# Altium project SensWear-V1R0.PrjPcb (part 2 of 2)

## Sheet SensWear_Power.SchDoc
size A4; Size: A4; ApprovedBy: Dariush Salami; DrawnBy: Yusein Ali; Engineer: Yusein Ali; Revision: A0; SheetNumber: 4; SheetTotal: 9
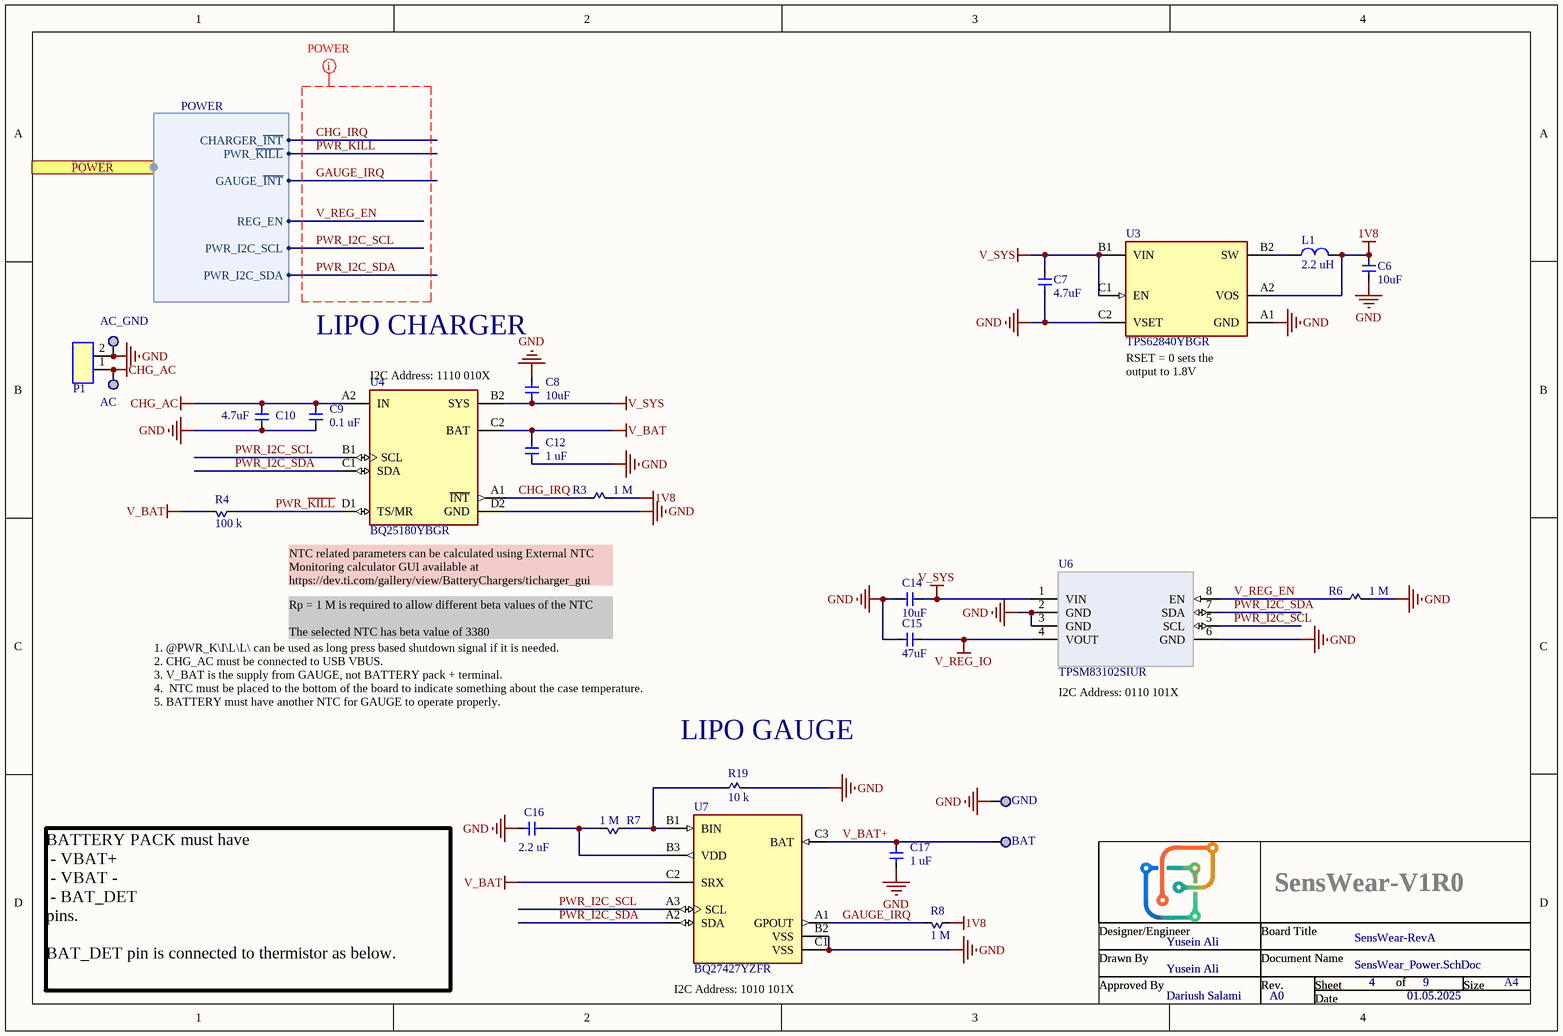
[diagram p3: SensWear_Power.SchDoc]

### Parts
AC  TESTPAD  [TEST_PAD]  (value not drawn)  (no BOM)
AC_GND  TESTPAD  [TEST_PAD]  (value not drawn)  (no BOM)
BAT  TESTPAD  [TEST_PAD]  (value not drawn)  (no BOM)
C6  10uF  [CAPC1005X05N]
C7  4.7uF  [CAPC1005X05N]
C8  10uF  [CAPC1005X05N]
C9  0.1 uF  [CAPC1005X05N]
C10  4.7uF  [CAPC1005X05N]
C12  1 uF  [CAPC1005X05N]
C14  10uF  [CAPC1005X05N]
C15  47uF  [CAPC1610X05N]
C16  2.2 uF  [CAPC1005X05N]
C17  1 uF  [CAPC1005X05N]
GND  TESTPAD  [TEST_PAD]  (value not drawn)  (no BOM)
L1  2.2 uH  [FP-DFE201612C-MFG]
P1  RM-1238-B02-41  [RM-1238-B02-41_2]  (value not drawn)
R3  1 M  [RESC1005X04N]
R4  100 k  [RESC1005X04N]
R6  1 M  [RESC1005X04N]
R7  1 M  [RESC1005X04N]
R8  1 M  [RESC1005X04N]
R19  10 k  [RESC1005X04N]
U3  TPS62840YBGR  [BGA6C40P2X3_97X147X50]
U4  BQ25180YBGR  [BGA8C40P2X4_104X159X50]
U6  TPSM83102SIUR  [MicroSiP8_SIU-A_TEX-M]
U7  BQ27427YZFR  [BGA9C50P3X3_158X162X62]

### Ports
POWER (harness POWER)

### Harnesses
POWER: CHARGER_~{INT}, PWR_I2C_SCL, PWR_~{KILL}, GAUGE_~{INT}, PWR_I2C_SDA, REG_EN

### Nets
1V8: C6.1 L1.2 R3.1 R8.1 U3.A2(VOS)
CHG_AC: AC.1 C9.1 C10.2 P1.1 U4.A2(IN)
GND: AC_GND.1 C6.2 C7.1 C8.2 C9.2 C10.1 C12.2 C14.1 C15.1 C16.2 C17.2 GND.1 P1.2 R6.1 R19.2 U3.A1(GND) U3.C2(VSET) U4.D2(GND) U6.2(GND) U6.3(GND) U6.6(GND) U7.B2(VSS) U7.C1(VSS)
V_BAT: C12.1 R4.2 U4.C2(BAT) U7.C2(SRX)
V_REG_IO: C15.2 U6.4(VOUT)
V_SYS: C7.2 C8.1 C14.2 U3.B1(VIN) U3.C1(EN) U4.B2(SYS) U6.1(VIN)
CHG_IRQ: R3.2 U4.A1(~{INT}) ; port POWER.CHARGER_~{INT}
GAUGE_IRQ: R8.2 U7.A1(GPOUT) ; port POWER.GAUGE_~{INT}
PWR_I2C_SCL: U4.B1(SCL) U6.5(SCL) U7.A3(SCL) ; port POWER.PWR_I2C_SCL
PWR_I2C_SDA: U4.C1(SDA) U6.7(SDA) U7.A2(SDA) ; port POWER.PWR_I2C_SDA
PWR_~{KILL}: R4.1 U4.D1(TS/MR) ; port POWER.PWR_~{KILL}
V_BAT+: BAT.1 C17.1 U7.C3(BAT)
V_REG_EN: R6.2 U6.8(EN) ; port POWER.REG_EN
NetC16_1: C16.1 R7.2 U7.B3(VDD)
NetL1_1: L1.1 U3.B2(SW)
NetR7_1: R7.1 R19.1 U7.B1(BIN)

### Layout directives
net class PWR Control: CHG_IRQ, GAUGE_IRQ, PWR_I2C_SCL, PWR_I2C_SDA, PWR_~{KILL}, V_REG_EN

### Notes on the sheet
- LIPO CHARGER
- I2C Address: 1110 010X
- (near U3) RSET = 0 sets the output to 1.8V
- NTC related parameters can be calculated using External NTC Monitoring calculator GUI available at https://dev.ti.com/gallery/view/BatteryChargers/ticharger_gui
- Rp = 1 M is required to allow different beta values of the NTC
  The selected NTC has beta value of 3380
- 1. @PWR_K\I\L\L\ can be used as long press based shutdown signal if it is needed.
  2. CHG_AC must be connected to USB VBUS.
  3. V_BAT is the supply from GAUGE, not BATTERY pack + terminal.
  4.  NTC must be placed to the bottom of the board to indicate something about the case temperature.
  5. BATTERY must have another NTC for GAUGE to operate properly.
- (near U6) I2C Address: 0110 101X
- (near R19) LIPO GAUGE
- BATTERY PACK must have
  - VBAT+
  - VBAT -
  - BAT_DET
  pins.
  BAT_DET pin is connected to thermistor as below.
- (near U7) I2C Address: 1010 101X
- Designer/Engineer
- Drawn By
- Document Name
- Board Title
- Sheet
- of
- Size
- A4
- Approved By
- Rev.
- Date

### Library data of the parts
AC AC_GND BAT GND = TESTPAD: TESTPOINT PIN SMD; Category: Test and Measurement; Type: PC Test Point; Mounting Type: Surface Mount; Color: -
C6 C8 C14 = CL05A106MP5NUNC: Multilayer Ceramic Capacitor, 10 uF, 10 V, ± 20%, X5R, 0402 [1005 Metric]; Manufacturer: Samsung; Voltage Rating: 10V; Supplier: Arrow Electronics; Supplier Part Number: CL05A106MP5NUNC; Manufacturer Part Number: CL05A106MP5NUNC; RoHS: Yes; Category: Ceramic Capacitors; Stock: 275; Pricing: 1=0,1584, 10=0,0737, 25=0,073, 100=0,0424, 250=0,042, 500=0,0416, 1000=0,0375 (USD); Mounting Technology: Surface Mount; Case/Package: 0402; Case Code (Metric): 1005; Case Code (Imperial): 0402; Min Operating Temperature: -55°C; Max Operating Temperature: 85°C; Package Quantity: 1; Packaging: Tape and Reel; Value: 10uF; Tolerance: 20%; Dielectric: X5R; Series: CL; Length: 1mm; Width: 0.02inch; Thickness: 0.028inch; Depth: 0.5mm; Radiation Hardening: No; Lead Free: Lead Free; RoHS Compliant: Yes; ComponentLink1URL: https://datasheet.ciiva.com/25721/cl05a106mp5nunc-25721584.pdf?src-supplier=Digi-Key; ComponentLink1Description: https://datasheet.ciiva.com/25721/cl05a106mp5nunc-25721584.pdf?src-supplier=Digi-Key; ComponentLink2URL: https://datasheet.ciiva.com/26838/getdatasheetpartid-745310-26838170.pdf?src-supplier=Verical; ComponentLink2Description: https://datasheet.ciiva.com/26838/getdatasheetpartid-745310-26838170.pdf?src-supplier=Verical; Supplier 1: Mouser; Supplier Part Number 1: 187-CL05A106MP5NUNC; Supplier 2: Digikey; Supplier Part Number 2: 1276-1450-1-ND
C7 C10 = GRM155R61A475MEAAD: Multilayer Ceramic Capacitor, 4.7 uF, 10 V, ± 20%, X5R, 0402 [1005 Metric]; Manufacturer: Murata; Material: 4241ConductorMaterial; Voltage Rating: 10V; Dielectric: 1537DielectricType; Manufacturer Part Number: GRM155R61A475MEAAD; RoHS: Yes; Category: Ceramic Capacitors; Stock: 930000; Pricing: 10000=0,0187, 50000=0,0159, 100000=0,0132 (USD); Mounting Technology: Surface Mount; Case/Package: 0402; Case Code (Imperial): 0402; Case Code (Metric): 1005; Min Operating Temperature: -55°C; Max Operating Temperature: 85°C; Packaging: Tape and Reel; Value: 4.7uF; Tolerance: 20%; Series: GRM; Voltage Rating (DC): 10V; Length: 1mm; Width: 500um; Height: 650um; Thickness: 500um; RoHS Compliant: Yes; ComponentLink1URL: http://www.farnell.com/datasheets/2189109.pdf?src-supplier=Farnell; ComponentLink1Description: http://www.farnell.com/datasheets/2189109.pdf?src-supplier=Farnell; ComponentLink2URL: http://www.farnell.com/datasheets/2189109.pdf?src-supplier=Newark; ComponentLink2Description: http://www.farnell.com/datasheets/2189109.pdf?src-supplier=Newark; ComponentLink3URL: http://www.farnell.com/datasheets/2189109.pdf?src-supplier=Element14; ComponentLink3Description: http://www.farnell.com/datasheets/2189109.pdf?src-supplier=Element14; ComponentLink4URL: http://datasheet.octopart.com/GRM155R61A475MEAAD-Murata-datasheet-68589269.pdf?src-supplier=Distrelec; ComponentLink4Description: http://datasheet.octopart.com/GRM155R61A475MEAAD-Murata-datasheet-68589269.pdf?src-supplier=Distrelec; ComponentLink5URL: http://datasheet.octopart.com/GRM155R61A475MEAAD-Murata-datasheet-68589269.pdf?src-supplier=Farnell; ComponentLink5Description: http://datasheet.octopart.com/GRM155R61A475MEAAD-Murata-datasheet-68589269.pdf?src-supplier=Farnell; ComponentLink6URL: https://search.murata.co.jp/Ceramy/image/img/A01X/G101/ENG/GRM155R61A475MEAA-01.pdf?src-supplier=Digi-Key; ComponentLink6Description: https://search.murata.co.jp/Ceramy/image/img/A01X/G101/ENG/GRM155R61A475MEAA-01.pdf?src-supplier=Digi-Key; ComponentLink7URL: http://datasheet.octopart.com/GRM155R61A475MEAAD-Murata-datasheet-68589269.pdf?src-supplier=Future+Electronics; ComponentLink7Description: http://datasheet.octopart.com/GRM155R61A475MEAAD-Murata-datasheet-68589269.pdf?src-supplier=Future+Electronics; ComponentLink8URL: https://datasheet.octopart.com/GRM155R61A475MEAAD-Murata-datasheet-68589269.pdf?src-supplier=Newark; ComponentLink8Description: https://datasheet.octopart.com/GRM155R61A475MEAAD-Murata-datasheet-68589269.pdf?src-supplier=Newark; ComponentLink9URL: http://datasheet.octopart.com/GRM155R61A475MEAAD-Murata-datasheet-68589269.pdf?src-supplier=Verical; ComponentLink9Description: http://datasheet.octopart.com/GRM155R61A475MEAAD-Murata-datasheet-68589269.pdf?src-supplier=Verical; ComponentLink10URL: https://datasheet.octopart.com/GRM155R61A475MEAAD-Murata-datasheet-165579666.pdf?src-supplier=TME; ComponentLink10Description: https://datasheet.octopart.com/GRM155R61A475MEAAD-Murata-datasheet-165579666.pdf?src-supplier=TME; ComponentLink11URL: http://datasheet.octopart.com/GRM155R61A475MEAAD-Murata-datasheet-68589269.pdf?src-supplier=Quest; ComponentLink11Description: http://datasheet.octopart.com/GRM155R61A475MEAAD-Murata-datasheet-68589269.pdf?src-supplier=Quest; ComponentLink12URL: http://datasheet.octopart.com/GRM155R61A475MEAAD-Murata-datasheet-68589269.pdf?src-supplier=TTI; ComponentLink12Description: http://datasheet.octopart.com/GRM155R61A475MEAAD-Murata-datasheet-68589269.pdf?src-supplier=TTI; ComponentLink13URL: http://datasheet.octopart.com/GRM155R61A475MEAAD-Murata-datasheet-68589269.pdf?src-supplier=NAC+Semi; ComponentLink13Description: http://datasheet.octopart.com/GRM155R61A475MEAAD-Murata-datasheet-68589269.pdf?src-supplier=NAC+Semi; Supplier 1: Mouser; Supplier Part Number 1: 81-GRM155R61A475MEAD; Supplier 2: Farnell; Supplier Part Number 2: 3581674
C9 = GRM155R61C104KA88D: CAP CER 0.1UF 16V X5R 0402; Manufacturer: Murata Electronics; Tolerance: 10 %; Type: Chip Multilayer Ceramic Capacitor for General Purpose; Voltage Rating DC: 16 VDC; Capacitance - nF: 100 nF; Capacitance - pF: 100000 pF; Supplier 1: Mouser; Manufacturer Part Number: GRM155R61C104KA88D; RoHS: RoHS Compliant; Category: Multilayer Ceramic Capacitors MLCC - SMD/SMT; Packaging: Cut Tape; Capacitance: 0.1 uF; Package / Case: 0402 (1005 metric); ComponentLink1URL: http://www.mouser.com/datasheet/2/281/murata_03052018_GRM_Series_1-1310166.pdf; ComponentLink1Description: http://www.mouser.com/datasheet/2/281/murata_03052018_GRM_Series_1-1310166.pdf; Supplier Part Number 1: 81-GRM155R61C104KA8D; Value: 0.1 uF; Stock: 0; Pricing: 1=0.082, 10=0.026, 100=0.011, 500=0.008, 1000=0.007, 2500=0.006, 5000=0.005, 10000=0.004 (EUR); Height: 0.5 mm; Length: 1 mm; Product: General Type MLCCs; Series: GRM; Termination Style: SMD/SMT; Width: 0.5 mm; Brand: Murata Electronics; Case Code - in: 0402; Case Code - mm: 1005; Dielectric: X5R; Maximum Operating Temperature: + 85 C; Minimum Operating Temperature: - 55 C; Standard Pack Qty: 10000; Termination: Standard; RoHS - Mouser: Y; Minimum Order Quantity: 1; Reeling: True; Supplier 2: Digikey; Supplier Part Number 2: 490-5415-1-ND; Supplier 3: Digikey; Supplier Part Number 3: 490-5415-6-ND
C12 C17 = GRM155R61A105KE15D: CAP CER 1UF 10V X5R 0402; Manufacturer: Murata Electronics North America; Capacitance: 1µF; Tolerance: ±10%; Supplier 1: Digi-Key; Manufacturer Part Number: GRM155R61A105KE15D; RoHS: RoHS Compliant; Category: Capacitors; Stock 1: 5520111; Pricing 1: 1=0.1, 10=0.024, 50=0.013, 100=0.011, 250=0.009, 500=0.0077, 1000=0.006, 5000=0.005 (USD); Packaging: Digi-Reel®; Part Status: Active; Voltage - Rated: 10V; Temperature Coefficient: X5R; Mounting Type: Surface Mount, MLCC; Operating Temperature: -55°C ~ 85°C; Applications: General Purpose; Ratings: -; Package / Case: 0402 (1005 Metric); Size / Dimension: 0.039" L x 0.020" W (1.00mm x 0.50mm); Height - Seated (Max): -; Thickness (Max): 0.022" (0.55mm); Lead Spacing: -; Features: -; Lead Style: -; ComponentLink1URL: http://www.murata.com/~/media/webrenewal/support/library/catalog/products/capacitor/mlcc/c02e.ashx; ComponentLink1Description: http://www.murata.com/~/media/webrenewal/support/library/catalog/products/capacitor/mlcc/c02e.ashx; Supplier Part Number 1: 490-3890-6-ND; Value: 1 uF
C15 = CL10A476MQ8QRNC: CL10 Series 0603 47 uF 6.3 V ±20% Tolerance X5R Multilayer Ceramic Capacitor; Manufacturer: Samsung; Supplier: Digikey; Supplier Part Number: 1276-CL10A476MQ8QRNCCT-ND; Manufacturer Part Number: CL10A476MQ8QRNC; RoHS: Yes; Category: Ceramic Capacitors; Stock: 103327; Pricing: 1=1.04, 10=0.669, 100=0.477, 1000=0.37689 (USD); Case/Package: 345Case; Min Operating Temperature: -55°C; Max Operating Temperature: 85°C; Value: 47uF; Tolerance: 20%; Lead Free: 5697LeadFree; RoHS Compliant: 5897YesNo; ComponentLink1URL: https://datasheet.octopart.com/CL10A476MQ8QRNC-Samsung-Electro-Mechanics-datasheet-68300278.pdf?src-supplier=Future+Electronics; ComponentLink1Description: https://datasheet.octopart.com/CL10A476MQ8QRNC-Samsung-Electro-Mechanics-datasheet-68300278.pdf?src-supplier=Future+Electronics; Supplier 1: Digikey; Supplier Part Number 1: 1276-CL10A476MQ8QRNCCT-ND; Supplier 2: Digikey; Supplier Part Number 2: 1276-CL10A476MQ8QRNCDKR-ND
C16 = GRM155R61A225KE95D: CAP CER 2.2UF 10V X5R 0402; Manufacturer: Murata Electronics North America; Capacitance: 2.2µF; Tolerance: ±10%; Supplier 1: Digi-Key; Manufacturer Part Number: GRM155R61A225KE95D; RoHS: RoHS Compliant; Category: Capacitors; Stock 1: 370562; Pricing 1: 1=0.1, 10=0.06, 50=0.0326, 100=0.0275, 250=0.02252, 500=0.01926, 1000=0.015, 5000=0.0125 (USD); Packaging: Digi-Reel®; Part Status: Active; Voltage - Rated: 10V; Temperature Coefficient: X5R; Operating Temperature: -55°C ~ 85°C; Features: Derating Recommended; Ratings: -; Applications: General Purpose; Mounting Type: Surface Mount, MLCC; Package / Case: 0402 (1005 Metric); Size / Dimension: 0.039" L x 0.020" W (1.00mm x 0.50mm); Height - Seated (Max): -; Thickness (Max): 0.022" (0.55mm); Lead Spacing: -; Lead Style: -; ComponentLink1URL: http://www.murata.com/~/media/webrenewal/support/library/catalog/products/capacitor/mlcc/c02e.ashx; ComponentLink1Description: http://www.murata.com/~/media/webrenewal/support/library/catalog/products/capacitor/mlcc/c02e.ashx; Supplier Part Number 1: 490-10451-6-ND; Value: 2.2 uF
L1 = DFE201612E-2R2M=P2: Inductor Power Shielded Wirewound 2.2uH 20% 1MHz Metal 1.8A 0.116Ohm DCR 0806 T/R; Manufacturer: Murata; Saturation Current: 2.4A; ESR: 116mR; Supplier: Mouser; Supplier Part Number: 81-DFE201612E-2R2MP2; Manufacturer Part Number: DFE201612E-2R2M=P2; RoHS: Yes; Category: Fixed Inductors; Stock: 102000; Pricing: 3000=0,0929 (USD); ComponentLink1URL: http://www.farnell.com/datasheets/2339714.pdf?src-supplier=Farnell; ComponentLink1Description: http://www.farnell.com/datasheets/2339714.pdf?src-supplier=Farnell; ComponentLink2URL: https://search.murata.co.jp/Ceramy/image/img/P02/J(E)TE243A-0006.pdf?src-supplier=Digi-Key; ComponentLink2Description: https://search.murata.co.jp/Ceramy/image/img/P02/J(E)TE243A-0006.pdf?src-supplier=Digi-Key; ComponentLink3URL: http://www.farnell.com/datasheets/2339714.pdf?src-supplier=Newark; ComponentLink3Description: http://www.farnell.com/datasheets/2339714.pdf?src-supplier=Newark; ComponentLink4URL: https://datasheet.octopart.com/DFE201612E-2R2M%3DP2-Murata-datasheet-150582460.pdf?src-supplier=Arrow.cn; ComponentLink4Description: https://datasheet.octopart.com/DFE201612E-2R2M%3DP2-Murata-datasheet-150582460.pdf?src-supplier=Arrow.cn; Supplier 1: Mouser; Supplier Part Number 1: 81-DFE201612E-2R2MP2; Value: 2.2 uH; Min Operating Temperature: -40°C; Max Operating Temperature: 125°C; Current Rating: 1.8A; Inductance Tolerance: 20%; Packaging: 13Packaging; RMS Current (Irms): 1.8A; Test Frequency: 1MHz; Height: 1.2mm; ComponentLink5URL: https://search.murata.co.jp/Ceramy/image/img/P02/J(E)TE243A-0006.pdf?src-supplier=Digikey; ComponentLink5Description: https://search.murata.co.jp/Ceramy/image/img/P02/J(E)TE243A-0006.pdf?src-supplier=Digikey; Supplier 2: Digikey; Supplier Part Number 2: 490-DFE201612E-2R2M=P2CT-ND; Supplier 3: Digikey; Supplier Part Number 3: 490-DFE201612E-2R2M=P2DKR-ND
P1 = RM-1238-B02-41: RM-1238-B02-41 by www.xtpogopin.com; Manufacturer: XTPogoPin; Manufacturer Part Number: RM-1238-B02-41
R3 R6-R8 = ERJ-2RKF1004X: RES SMD 1M OHM 1% 1/10W 0402; Manufacturer: Panasonic Electronic Components; Power (Watts): 0.1W, 1/10W; Temperature Coefficient: ±100ppm/°C; Supplier 1: Digi-Key; Manufacturer Part Number: ERJ-2RKF1004X; RoHS: RoHS Compliant; Category: Resistors; Stock 1: 1590446; Pricing 1: 1=0.1, 10=0.025, 25=0.018, 50=0.0136, 100=0.01, 250=0.00764, 500=0.00612, 1000=0.00451, 5000=0.00323 (USD); Packaging: Digi-Reel®; Part Status: Active; Resistance (Ohms): 1M; Tolerance: ±1%; Composition: Thick Film; Features: Automotive AEC-Q200; Operating Temperature: -55°C ~ 155°C; Package / Case: 0402 (1005 Metric); Supplier Device Package: 0402; Size / Dimension: 0.039" L x 0.020" W (1.00mm x 0.50mm); Number of Terminations: 2; Failure Rate: -; ComponentLink1URL: https://industrial.panasonic.com/cdbs/www-data/pdf/RDA0000/AOA0000C283.pdf; ComponentLink1Description: https://industrial.panasonic.com/cdbs/www-data/pdf/RDA0000/AOA0000C283.pdf; Supplier Part Number 1: P1.00MLDKR-ND; Value: 1 M; Height - Seated (Max): 0.016" (0.40mm)
R4 = ERJ-2RKF1003X: RES SMD 100K OHM 1% 1/10W 0402; Manufacturer: Panasonic Electronic Components; Power (Watts): 0.1W, 1/10W; Temperature Coefficient: ±100ppm/°C; Supplier 1: Digi-Key; Manufacturer Part Number: ERJ-2RKF1003X; RoHS: RoHS Compliant; Category: Resistors; Stock 1: 5976308; Pricing 1: 1=0.1, 10=0.025, 25=0.018, 50=0.0136, 100=0.01, 250=0.00764, 500=0.00612, 1000=0.00451, 5000=0.00323 (USD); Packaging: Digi-Reel®; Part Status: Active; Resistance (Ohms): 100k; Tolerance: ±1%; Composition: Thick Film; Features: Automotive AEC-Q200; Operating Temperature: -55°C ~ 155°C; Package / Case: 0402 (1005 Metric); Supplier Device Package: 0402; Size / Dimension: 0.039" L x 0.020" W (1.00mm x 0.50mm); Height - Seated (Max): 0.016" (0.40mm); Number of Terminations: 2; Failure Rate: -; ComponentLink1URL: https://industrial.panasonic.com/cdbs/www-data/pdf/RDA0000/AOA0000C283.pdf; ComponentLink1Description: https://industrial.panasonic.com/cdbs/www-data/pdf/RDA0000/AOA0000C283.pdf; Supplier Part Number 1: P100KLDKR-ND; Value: 100 k
R19 = ERJ-2RKF1002X: RES SMD 10K OHM 1% 1/10W 0402; Manufacturer: Panasonic Electronic Components; Power (Watts): 0.1W, 1/10W; Temperature Coefficient: ±100ppm/°C; Supplier 1: Digi-Key; Manufacturer Part Number: ERJ-2RKF1002X; RoHS: RoHS Compliant; Category: Resistors; Stock 1: 8105773; Pricing 1: 1=0.1, 10=0.025, 25=0.018, 50=0.0136, 100=0.01, 250=0.00764, 500=0.00612, 1000=0.00451, 5000=0.00323 (USD); Packaging: Digi-Reel®; Part Status: Active; Resistance (Ohms): 10k; Tolerance: ±1%; Composition: Thick Film; Features: Automotive AEC-Q200; Operating Temperature: -55°C ~ 155°C; Package / Case: 0402 (1005 Metric); Supplier Device Package: 0402; Size / Dimension: 0.039" L x 0.020" W (1.00mm x 0.50mm); Height - Seated (Max): 0.016" (0.40mm); Number of Terminations: 2; Failure Rate: -; ComponentLink1URL: https://industrial.panasonic.com/cdbs/www-data/pdf/RDA0000/AOA0000C283.pdf; ComponentLink1Description: https://industrial.panasonic.com/cdbs/www-data/pdf/RDA0000/AOA0000C283.pdf; Supplier Part Number 1: P10.0KLDKR-ND; Value: 10 k
U3 = TPS62840YBGR: Conv DC-DC 1.8V to 6.5V Synchronous Step Down Single-Out 1.8V to 3.3V 0.75A 6-Pin DSBGA T/R; Manufacturer: Texas Instruments; Supplier: Mouser; Supplier Part Number: 595-TPS62840YBGR; Manufacturer Part Number: TPS62840YBGR; RoHS: Yes; Category: Voltage Regulators - Switching; Stock: 2271; Pricing: 1=1,97, 10=1,77, 50=1,77, 100=1,42, 1000=0,972, 10000=0,865 (USD); Supplier 1: Mouser; Supplier Part Number 1: 595-TPS62840YBGR
U4 = BQ25180YBGR: 1-A Li-ion I²C programmable charger with regulated power path in WCSP package 8-DSBGA -40 to 85; Manufacturer: Texas Instruments; Supplier: Digi-Key; Supplier Part Number: 296-BQ25180YBGRCT-ND; Manufacturer Part Number: BQ25180YBGR; RoHS: No; Category: Integrated Circuits (ICs); Stock: 2812; Pricing: 1=2,65, 10=2,382, 25=2,2472, 100=1,9147, 250=1,7978, 500=1,57308, 1000=1,3034 (USD); Supplier 1: Mouser; Supplier Part Number 1: 595-BQ25180YBGR
U6 = TPSM83102SIUR: 1.5A output current, buck-boost MicroSiP™ power module with integrated inductor with I²C 8-uSiP -40 to 125; Manufacturer: Texas Instruments; Supplier: Mouser; Supplier Part Number: 595-TPSM83102SIUR; Manufacturer Part Number: TPSM83102SIUR; RoHS: No; Stock: 2997; Pricing: 1=6.7, 10=6.01, 50=6.01, 100=4.93, 1000=4.51, 10000=3.83 (USD); Pins: 8; Topology: Buck-Boost; Length: 2.6mm; Width: 2mm; Thickness: 1.15mm; Supplier 1: Mouser; Supplier Part Number 1: 595-TPSM83102SIUR; Supplier 2: Digikey; Supplier Part Number 2: 296-TPSM83102SIURCT-ND
U7 = BQ27427YZFR: Single-cell battery fuel gauge with pre-programmed chemistry and integrated sense resistor 9-DSBGA -40 to 85; Manufacturer: Texas Instruments; Supplier: Mouser; Supplier Part Number: 595-BQ27427YZFR; Manufacturer Part Number: BQ27427YZFR; RoHS: No; Stock: 1221; Pricing: 1=2,56, 10=2,31, 50=2,18, 100=1,86, 1000=1,26, 10000=1,15 (USD); Supplier 1: Mouser; Supplier Part Number 1: 595-BQ27427YZFR

## Sheet SensWear_MPU.SchDoc
size A4; Size: A4; ApprovedBy: Dariush Salami; DrawnBy: Yusein Ali; Engineer: Yusein Ali; Revision: A0; SheetNumber: 5; SheetTotal: 9
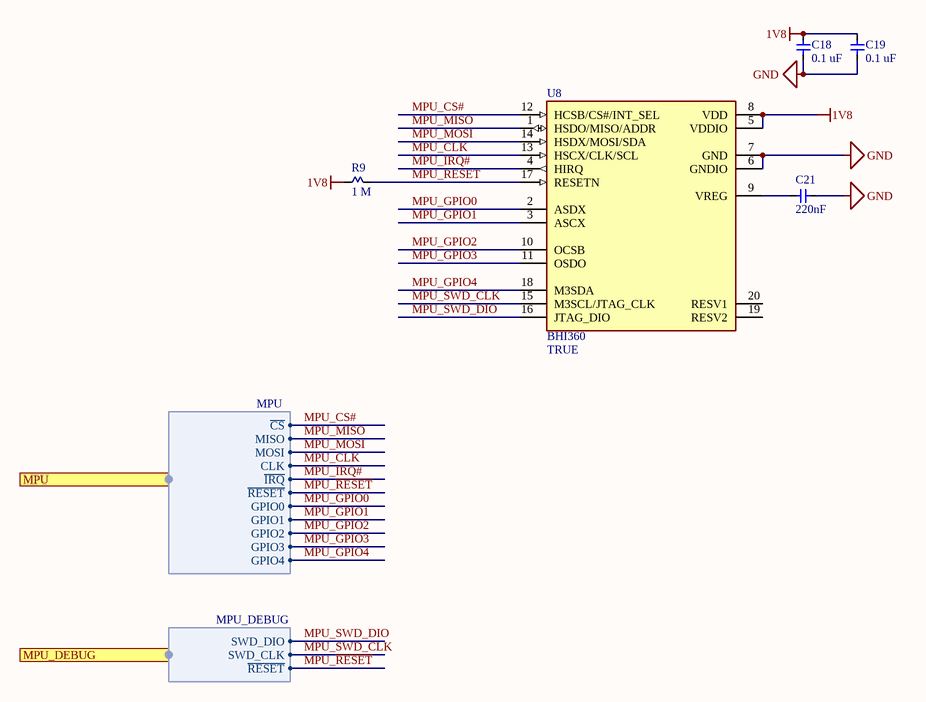
[diagram p4: SensWear_MPU.SchDoc]

### Parts
C18  0.1 uF  [CAPC1005X05N]
C19  0.1 uF  [CAPC1005X05N]
C21  220nF  [CAPC1005X05N]
R9  1 M  [RESC1005X04N]
U8  BHI360  Checked: TRUE  [BHI360]

### Ports
MPU (harness MPU), MPU_DEBUG (harness MPU_DEBUG)

### Harnesses
MPU: ~{CS}, MISO, MOSI, CLK, ~{IRQ}, ~{RESET}, GPIO0, GPIO1, GPIO2, GPIO3, GPIO4
MPU_DEBUG: SWD_DIO, SWD_CLK, ~{RESET}

### Nets
1V8: C18.2 C19.2 R9.1 U8.5(VDDIO) U8.8(VDD)
GND: C18.1 C19.1 C21.2 U8.6(GNDIO) U8.7(GND)
MPU_CLK: U8.13(HSCX/CLK/SCL) ; port MPU.CLK
MPU_CS#: U8.12(HCSB/CS#/INT_SEL) ; port MPU.~{CS}
MPU_GPIO0: U8.2(ASDX) ; port MPU.GPIO0
MPU_GPIO1: U8.3(ASCX) ; port MPU.GPIO1
MPU_GPIO2: U8.10(OCSB) ; port MPU.GPIO2
MPU_GPIO3: U8.11(OSDO) ; port MPU.GPIO3
MPU_GPIO4: U8.18(M3SDA) ; port MPU.GPIO4
MPU_IRQ#: U8.4(HIRQ) ; port MPU.~{IRQ}
MPU_MISO: U8.1(HSDO/MISO/ADDR) ; port MPU.MISO
MPU_MOSI: U8.14(HSDX/MOSI/SDA) ; port MPU.MOSI
MPU_~{RESET}: R9.2 U8.17(RESETN) ; port MPU.~{RESET}, port MPU_DEBUG.~{RESET}
MPU_SWD_CLK: U8.15(M3SCL/JTAG_CLK) ; port MPU_DEBUG.SWD_CLK
MPU_SWD_DIO: U8.16(JTAG_DIO) ; port MPU_DEBUG.SWD_DIO
NetC21_1: C21.1 U8.9(VREG)

Not connected (* = marked no-connect by the designer): U8 19(RESV2) 20(RESV1)

### Notes on the sheet
- Designer/Engineer
- Drawn By
- Document Name
- Board Title
- Sheet
- of
- Size
- A4
- Approved By
- Rev.
- Date

### Library data of the parts
C18 C19 = GRM155R61C104KA88D: as C9 on sheet SensWear_Power; Manufacturer Part Number: GRM155R61C104KA88D; RoHS: RoHS Compliant; Category: Multilayer Ceramic Capacitors MLCC - SMD/SMT; Stock: 0; Pricing: 1=0.082, 10=0.026, 100=0.011, 500=0.008, 1000=0.007, 2500=0.006, 5000=0.005, 10000=0.004 (EUR); Capacitance: 0.1 uF; Height: 0.5 mm; Length: 1 mm; Package / Case: 0402 (1005 metric); Packaging: Cut Tape; Product: General Type MLCCs; Series: GRM; Termination Style: SMD/SMT; Width: 0.5 mm; Brand: Murata Electronics; Case Code - in: 0402; Case Code - mm: 1005; Dielectric: X5R; Maximum Operating Temperature: + 85 C; Minimum Operating Temperature: - 55 C; Standard Pack Qty: 10000; Termination: Standard; RoHS - Mouser: Y; Minimum Order Quantity: 1; Reeling: True; ComponentLink1URL: http://www.mouser.com/datasheet/2/281/murata_03052018_GRM_Series_1-1310166.pdf; ComponentLink1Description: http://www.mouser.com/datasheet/2/281/murata_03052018_GRM_Series_1-1310166.pdf; Value: 0.1 uF; Supplier 1: Mouser; Supplier Part Number 1: 81-GRM155R61C104KA8D; Supplier 2: Digikey; Supplier Part Number 2: 490-5415-1-ND; Supplier 3: Digikey; Supplier Part Number 3: 490-5415-6-ND
C21 = GRM155R61C224KA12D: CAP CER 0.22UF 16V X5R 0402; Manufacturer: Murata; Supplier: Mouser; Supplier Part Number: 81-GRM155R61C224KA2D; Manufacturer Part Number: GRM155R61C224KA12D; RoHS: Yes; Category: Ceramic Capacitors; Stock: 8589; Pricing: 1=0.1, 10=0.043, 50=0.043, 100=0.026, 1000=0.017, 10000=0.009 (USD); Lead Free: 5697LeadFree; ComponentLink1URL: http://www.mouser.com/ds/2/281/c02e-2905.pdf?src-supplier=Mouser; ComponentLink1Description: http://www.mouser.com/ds/2/281/c02e-2905.pdf?src-supplier=Mouser; ComponentLink2URL: https://www.murata.com/~/media/webrenewal/support/library/catalog/products/capacitor/mlcc/c02e.ashx?la=en-us&src-supplier=Digikey; ComponentLink2Description: https://www.murata.com/~/media/webrenewal/support/library/catalog/products/capacitor/mlcc/c02e.ashx?la=en-us&src-supplier=Digikey; ComponentLink3URL: http://search.murata.co.jp/Ceramy/image/img/A01X/G101/ENG/GRM155R61C224KA12-01.pdf?src-supplier=Digikey; ComponentLink3Description: http://search.murata.co.jp/Ceramy/image/img/A01X/G101/ENG/GRM155R61C224KA12-01.pdf?src-supplier=Digikey; ComponentLink4URL: http://search.murata.co.jp/Ceramy/image/img/A01X/partnumbering_e_01.pdf?src-supplier=Digikey; ComponentLink4Description: http://search.murata.co.jp/Ceramy/image/img/A01X/partnumbering_e_01.pdf?src-supplier=Digikey; ComponentLink5URL: https://datasheet.octopart.com/GRM155R61C224KA12D-Murata-datasheet-22122223.pdf?src-supplier=Future+Electronics; ComponentLink5Description: https://datasheet.octopart.com/GRM155R61C224KA12D-Murata-datasheet-22122223.pdf?src-supplier=Future+Electronics; Value: 220nF; Supplier 1: Mouser; Supplier Part Number 1: 81-GRM155R61C224KA2D; Supplier 2: Digikey; Supplier Part Number 2: 490-11416-1-ND
R9 = ERJ-2RKF1004X: as R3 on sheet SensWear_Power; Supplier 1: Digi-Key; Manufacturer Part Number: ERJ-2RKF1004X; RoHS: RoHS Compliant; Category: Resistors; Stock 1: 1590446; Pricing 1: 1=0.1, 10=0.025, 25=0.018, 50=0.0136, 100=0.01, 250=0.00764, 500=0.00612, 1000=0.00451, 5000=0.00323 (USD); Packaging: Digi-Reel®; Part Status: Active; Resistance (Ohms): 1M; Tolerance: ±1%; Composition: Thick Film; Features: Automotive AEC-Q200; Operating Temperature: -55°C ~ 155°C; Package / Case: 0402 (1005 Metric); Supplier Device Package: 0402; Size / Dimension: 0.039" L x 0.020" W (1.00mm x 0.50mm); Height - Seated (Max): 0.016" (0.40mm); Number of Terminations: 2; Failure Rate: -; ComponentLink1URL: https://industrial.panasonic.com/cdbs/www-data/pdf/RDA0000/AOA0000C283.pdf; ComponentLink1Description: https://industrial.panasonic.com/cdbs/www-data/pdf/RDA0000/AOA0000C283.pdf; Supplier Part Number 1: P1.00MLDKR-ND; Value: 1 M
U8 = BHI360: Programmable smart sensor combining accelerometer, gyroscope and fusion software; Manufacturer: Bosch Tools; Supplier: Digikey; Supplier Part Number: 828-BHI360DKR-ND; Manufacturer Part Number: BHI360; RoHS: No; Category: Uncategorized; Stock: 17060; Pricing: 1=6.54, 10=5.232, 25=4.8396, 100=4.1854, 500=3.92384, 1000=3.66226 (USD); Supplier 1: Digikey; Supplier Part Number 1: 828-BHI360DKR-ND; Supplier 2: Mouser; Supplier Part Number 2: 262-BHI360

## Sheet SensWear_RGB.SchDoc
size A4; Size: A4; ApprovedBy: Dariush Salami; DrawnBy: Yusein Ali; Engineer: Yusein Ali; Revision: A0; SheetNumber: 6; SheetTotal: 9
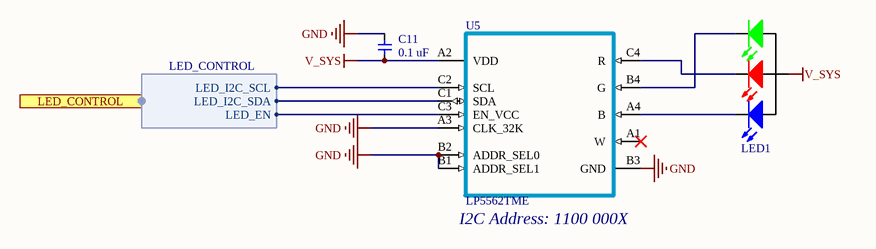
[diagram p5: SensWear_RGB.SchDoc]

### Parts
C11  0.1 uF  [CAPC1005X05N]
LED1  SML-LX0404SIUPGUSB  [SML-LX0404SIUPGUSB]  (value not drawn)
U5  LP5562TME  [BGA12C40P4X3_162X122X68]

### Ports
LED_CONTROL (harness LED_CONTROL)

### Harnesses
LED_CONTROL: LED_I2C_SCL, LED_I2C_SDA, LED_EN

### Nets
GND: C11.2 U5.A3(CLK_32K) U5.B1(ADDR_SEL1) U5.B2(ADDR_SEL0) U5.B3(GND)
V_SYS: C11.1 LED1.1(A) U5.A2(VDD)
NetLED1_2: LED1.2(K) U5.C4(R)
NetLED1_3: LED1.3(K) U5.A4(B)
NetLED1_4: LED1.4(K) U5.B4(G)
NetU5_C1: U5.C1(SDA) ; port LED_CONTROL.LED_I2C_SDA
NetU5_C2: U5.C2(SCL) ; port LED_CONTROL.LED_I2C_SCL
NetU5_C3: U5.C3(EN_VCC) ; port LED_CONTROL.LED_EN

Not connected (* = marked no-connect by the designer): U5 A1(W)*

### Notes on the sheet
- (near U5) I2C Address: 1100 000X
- Designer/Engineer
- Drawn By
- Document Name
- Board Title
- Sheet
- of
- Size
- A4
- Approved By
- Rev.
- Date

### Library data of the parts
C11 = GRM155R61C104KA88D: as C9 on sheet SensWear_Power; Supplier 1: Mouser; Manufacturer Part Number: GRM155R61C104KA88D; RoHS: RoHS Compliant; Category: Multilayer Ceramic Capacitors MLCC - SMD/SMT; Packaging: Cut Tape; Capacitance: 0.1 uF; Package / Case: 0402 (1005 metric); ComponentLink1URL: http://www.mouser.com/datasheet/2/281/murata_03052018_GRM_Series_1-1310166.pdf; ComponentLink1Description: http://www.mouser.com/datasheet/2/281/murata_03052018_GRM_Series_1-1310166.pdf; Supplier Part Number 1: 81-GRM155R61C104KA8D; Value: 0.1 uF; Stock: 0; Pricing: 1=0.082, 10=0.026, 100=0.011, 500=0.008, 1000=0.007, 2500=0.006, 5000=0.005, 10000=0.004 (EUR); Height: 0.5 mm; Length: 1 mm; Product: General Type MLCCs; Series: GRM; Termination Style: SMD/SMT; Width: 0.5 mm; Brand: Murata Electronics; Case Code - in: 0402; Case Code - mm: 1005; Dielectric: X5R; Maximum Operating Temperature: + 85 C; Minimum Operating Temperature: - 55 C; Standard Pack Qty: 10000; Termination: Standard; RoHS - Mouser: Y; Minimum Order Quantity: 1; Reeling: True; Supplier 2: Digikey; Supplier Part Number 2: 490-5415-1-ND; Supplier 3: Digikey; Supplier Part Number 3: 490-5415-6-ND
LED1 = SML-LX0404SIUPGUSB: LED Low-Power Tri-Color Blue/Green/Red 465nm/518nm/632nm 2.7V/2.75V/1.95V 4-Pin SMD T/R; Manufacturer: Lumex; Color: Blue,Green,Red; Lens Color: Colorless; Lens Transparency: Clear; Viewing Angle: 120°; Lens Style: Square,Clear,Rectangular; Forward Current: 2mA; Luminous Intensity: 20mcd; Forward Voltage: 2.73V; Number of LEDs: 3; Wavelength: 465nm; Power Rating: 30mW; Reverse Voltage: 5V; Manufacturer Part Number: SML-LX0404SIUPGUSB; RoHS: Yes; Category: LEDs; Packaging: Tape and Reel; ComponentLink1URL: https://datasheet.ciiva.com/1246/1423960-1246392.pdf?src-supplier=Element14; ComponentLink1Description: https://datasheet.ciiva.com/1246/1423960-1246392.pdf?src-supplier=Element14; Supplier: Mouser; Supplier Part Number: 696-LX0404SIUPGUSB; Stock: 113976; Pricing: 1=0.94, 10=0.633, 50=0.633, 100=0.518, 1000=0.444, 10000=0.371 (USD); Mounting Technology: Surface Mount; Case/Package: 0404; Case Code (Metric): 1010; Case Code (Imperial): 0404; Min Operating Temperature: -40°C; Max Operating Temperature: 85°C; Package Quantity: 2000; Test Current: 2mA; Series: -; Moisture Sensitivity Level: 4; Length: 1mm; Width: 1mm; Height: 0.3mm; Reach SVHC Compliant: No; Lead Free: Lead Free; RoHS Compliant: Yes; ComponentLink2URL: https://datasheet.ciiva.com/1333/lumex-quasarbrite-0404smdrgb-productbrochure-1333009.pdf?src-supplier=Newark; ComponentLink2Description: https://datasheet.ciiva.com/1333/lumex-quasarbrite-0404smdrgb-productbrochure-1333009.pdf?src-supplier=Newark; ComponentLink3URL: https://datasheet.ciiva.com/2118/sml-lx0404siupgusb-2118652.pdf?src-supplier=Digikey; ComponentLink3Description: https://datasheet.ciiva.com/2118/sml-lx0404siupgusb-2118652.pdf?src-supplier=Digikey; ComponentLink4URL: https://datasheet.ciiva.com/4689/sml-lx0404siupgusb-202559-4689572.pdf?src-supplier=Mouser; ComponentLink4Description: https://datasheet.ciiva.com/4689/sml-lx0404siupgusb-202559-4689572.pdf?src-supplier=Mouser; ComponentLink5URL: https://datasheet.ciiva.com/16199/sml-lx0404siupgusb-16199820.pdf?src-supplier=Future+Electronics; ComponentLink5Description: https://datasheet.ciiva.com/16199/sml-lx0404siupgusb-16199820.pdf?src-supplier=Future+Electronics; ComponentLink6URL: https://datasheet.ciiva.com/1246/1484526-1246779.pdf?src-supplier=Element14; ComponentLink6Description: https://datasheet.ciiva.com/1246/1484526-1246779.pdf?src-supplier=Element14; ComponentLink7URL: https://datasheet.ciiva.com/2118/sml-lx0404siupgusb-2118653.pdf?src-supplier=Digikey; ComponentLink7Description: https://datasheet.ciiva.com/2118/sml-lx0404siupgusb-2118653.pdf?src-supplier=Digikey; ComponentLink8URL: https://datasheet.ciiva.com/2118/sml-lx0404siupgusb-2118654.pdf?src-supplier=Digikey; ComponentLink8Description: https://datasheet.ciiva.com/2118/sml-lx0404siupgusb-2118654.pdf?src-supplier=Digikey; ComponentLink9URL: https://datasheet.ciiva.com/14604/70127422-14604949.pdf?src-supplier=Allied+Electronics; ComponentLink9Description: https://datasheet.ciiva.com/14604/70127422-14604949.pdf?src-supplier=Allied+Electronics
U5 = LP5562TME/NOPB: IC LED DRIVER LINEAR DIM 25.5MA; Manufacturer: Texas Instruments; Internal Switch(s): Yes; Number of Outputs: 4; Voltage - Supply (Min): 2.7V; Voltage - Supply (Max): 5.5V; Frequency: 256kHz, 558kHz; Dimming: I²C; Supplier 1: Digi-Key; Manufacturer Part Number: LP5562TME/NOPB; RoHS: RoHS Compliant; Category: Integrated Circuits (ICs); Stock 1: 4154; Pricing 1: 1=1.34, 10=1.195, 100=0.9314 (USD); Packaging: Digi-Reel®; Part Status: Active; Type: Linear; Topology: -; Voltage - Output: -; Current - Output / Channel: 25.5mA; Applications: Backlight; Operating Temperature: -40°C ~ 85°C (TA); Mounting Type: Surface Mount; Package / Case: 12-WFBGA, DSBGA; Supplier Device Package: 12-DSBGA; ComponentLink1URL: http://www.ti.com/lit/ds/symlink/lp5562.pdf; ComponentLink1Description: http://www.ti.com/lit/ds/symlink/lp5562.pdf; Supplier Part Number 1: 296-39060-6-ND

## Sheet SensWear_Debug.SchDoc
size A4; Size: A4; ApprovedBy: Dariush Salami; DrawnBy: Yusein Ali; Engineer: Yusein Ali; Revision: A0; SheetNumber: 7; SheetTotal: 9
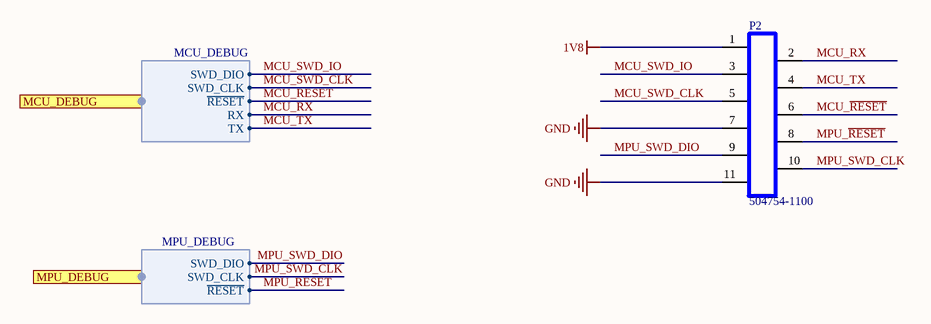
[diagram p6: SensWear_Debug.SchDoc]

### Parts
P2  504754-1100  [5047541100]

### Ports
MCU_DEBUG (harness MCU_DEBUG), MPU_DEBUG (harness MPU_DEBUG)

### Harnesses
MPU_DEBUG: SWD_DIO, SWD_CLK, ~{RESET}
MCU_DEBUG: SWD_DIO, SWD_CLK, ~{RESET}, RX, TX

### Nets
1V8: P2.1
GND: P2.7 P2.11
MCU_~{RESET}: P2.6 ; port MCU_DEBUG.~{RESET}
MCU_RX: P2.2 ; port MCU_DEBUG.RX
MCU_SWD_CLK: P2.5 ; port MCU_DEBUG.SWD_CLK
MCU_SWD_IO: P2.3 ; port MCU_DEBUG.SWD_DIO
MCU_TX: P2.4 ; port MCU_DEBUG.TX
MPU_~{RESET}: P2.8 ; port MPU_DEBUG.~{RESET}
MPU_SWD_CLK: P2.10 ; port MPU_DEBUG.SWD_CLK
MPU_SWD_DIO: P2.9 ; port MPU_DEBUG.SWD_DIO

### Notes on the sheet
- Designer/Engineer
- Drawn By
- Document Name
- Board Title
- Sheet
- of
- Size
- A4
- Approved By
- Rev.
- Date

### Library data of the parts
P2 = 504754-1100: Conn FFC/FPC Connector SKT 11 POS 0.3mm Solder RA SMD Easy-On™ T/R; Manufacturer: Molex; CHECKED: FALSE; Supplier: Mouser; Supplier Part Number: 538-504754-1100; Manufacturer Part Number: 504754-1100; RoHS: No; Stock: 6459; Pricing: 1=0.77, 10=0.628, 50=0.544, 100=0.512, 1000=0.426, 10000=0.355 (USD); ComponentLink1URL: https://datasheet.octopart.com/504754-1100-Molex-datasheet-169278456.pdf?src-supplier=Farnell; ComponentLink1Description: https://datasheet.octopart.com/504754-1100-Molex-datasheet-169278456.pdf?src-supplier=Farnell; ComponentLink2URL: http://datasheet.octopart.com/5047541100-Molex-datasheet-38188796.pdf?src-supplier=Onlinecomponents.com; ComponentLink2Description: http://datasheet.octopart.com/5047541100-Molex-datasheet-38188796.pdf?src-supplier=Onlinecomponents.com; ComponentLink3URL: http://datasheet.octopart.com/5047541100-Molex-datasheet-38188796.pdf?src-supplier=Verical; ComponentLink3Description: http://datasheet.octopart.com/5047541100-Molex-datasheet-38188796.pdf?src-supplier=Verical; ComponentLink4URL: http://datasheet.octopart.com/5047541100-Molex-datasheet-38188796.pdf?src-supplier=Avnet; ComponentLink4Description: http://datasheet.octopart.com/5047541100-Molex-datasheet-38188796.pdf?src-supplier=Avnet; ComponentLink5URL: http://datasheet.octopart.com/5047541100-Molex-datasheet-38188796.pdf?src-supplier=TTI; ComponentLink5Description: http://datasheet.octopart.com/5047541100-Molex-datasheet-38188796.pdf?src-supplier=TTI; ComponentLink6URL: http://datasheet.octopart.com/5047541100-Molex-datasheet-38188796.pdf?src-supplier=Electro+Sonic; ComponentLink6Description: http://datasheet.octopart.com/5047541100-Molex-datasheet-38188796.pdf?src-supplier=Electro+Sonic; ComponentLink7URL: https://datasheet.octopart.com/504754-1100-Molex-datasheet-154754160.pdf?src-supplier=Master+Electronics; ComponentLink7Description: https://datasheet.octopart.com/504754-1100-Molex-datasheet-154754160.pdf?src-supplier=Master+Electronics; Supplier 1: Mouser; Supplier Part Number 1: 538-504754-1100

## Sheet SensWear_TitlePage.SchDoc
size A4; Size: A4; ApprovedBy: Dariush Salami; DrawnBy: Yusein Ali; Engineer: Yusein Ali; Revision: A0; SheetNumber: 8; SheetTotal: 9

### Notes on the sheet
- Designer/Engineer
- Drawn By
- Document Name
- Board Title
- Sheet
- of
- Size
- A4
- Approved By
- Rev.
- Date

## Sheet SensWear_DaughterBoard.SchDoc
size A4; SheetNumber: 9; SheetTotal: 9
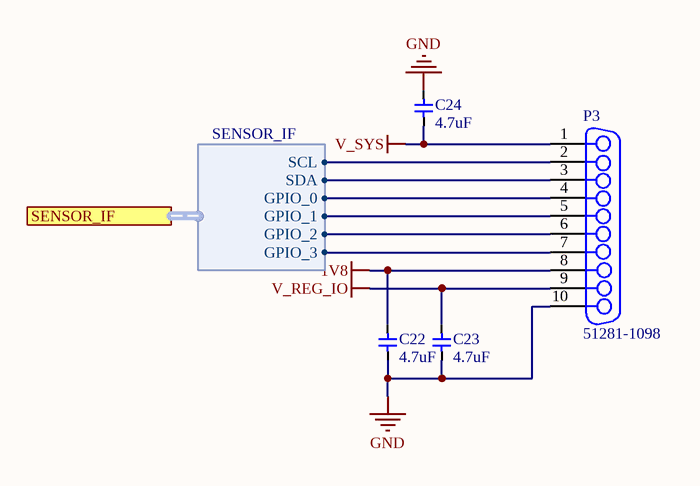
[diagram p7: SensWear_DaughterBoard.SchDoc]

### Parts
C22  4.7uF  [CAPC1005X05N]
C23  4.7uF  [CAPC1005X05N]
C24  4.7uF  [CAPC1005X05N]
P3  51281-1098  [51281-1098]

### Ports
SENSOR_IF (harness SENSOR_IF)

### Harnesses
SENSOR_IF: SCL, SDA, GPIO_0, GPIO_1, GPIO_2, GPIO_3

### Nets
1V8: C22.2 P3.8
GND: C22.1 C23.1 C24.2 P3.10
V_REG_IO: C23.2 P3.9
V_SYS: C24.1 P3.1
NetP3_2: P3.2 ; port SENSOR_IF.SCL
NetP3_3: P3.3 ; port SENSOR_IF.SDA
NetP3_4: P3.4 ; port SENSOR_IF.GPIO_0
NetP3_5: P3.5 ; port SENSOR_IF.GPIO_1
NetP3_6: P3.6 ; port SENSOR_IF.GPIO_2
NetP3_7: P3.7 ; port SENSOR_IF.GPIO_3

### Notes on the sheet
- Designer/Engineer
- Drawn By
- Document Name
- Board Title
- Sheet
- of
- Size
- A4
- Approved By
- Rev.
- Date

### Library data of the parts
C22-C24 = GRM155R61A475MEAAD: as C7 on sheet SensWear_Power; Manufacturer Part Number: GRM155R61A475MEAAD; RoHS: Yes; Category: Ceramic Capacitors; Stock: 930000; Pricing: 10000=0,0187, 50000=0,0159, 100000=0,0132 (USD); Mounting Technology: Surface Mount; Case/Package: 0402; Case Code (Imperial): 0402; Case Code (Metric): 1005; Min Operating Temperature: -55°C; Max Operating Temperature: 85°C; Packaging: Tape and Reel; Value: 4.7uF; Tolerance: 20%; Series: GRM; Voltage Rating (DC): 10V; Length: 1mm; Width: 500um; Height: 650um; Thickness: 500um; RoHS Compliant: Yes; ComponentLink1URL: http://www.farnell.com/datasheets/2189109.pdf?src-supplier=Farnell; ComponentLink1Description: http://www.farnell.com/datasheets/2189109.pdf?src-supplier=Farnell; ComponentLink2URL: http://www.farnell.com/datasheets/2189109.pdf?src-supplier=Newark; ComponentLink2Description: http://www.farnell.com/datasheets/2189109.pdf?src-supplier=Newark; ComponentLink3URL: http://www.farnell.com/datasheets/2189109.pdf?src-supplier=Element14; ComponentLink3Description: http://www.farnell.com/datasheets/2189109.pdf?src-supplier=Element14; ComponentLink4URL: http://datasheet.octopart.com/GRM155R61A475MEAAD-Murata-datasheet-68589269.pdf?src-supplier=Distrelec; ComponentLink4Description: http://datasheet.octopart.com/GRM155R61A475MEAAD-Murata-datasheet-68589269.pdf?src-supplier=Distrelec; ComponentLink5URL: http://datasheet.octopart.com/GRM155R61A475MEAAD-Murata-datasheet-68589269.pdf?src-supplier=Farnell; ComponentLink5Description: http://datasheet.octopart.com/GRM155R61A475MEAAD-Murata-datasheet-68589269.pdf?src-supplier=Farnell; ComponentLink6URL: https://search.murata.co.jp/Ceramy/image/img/A01X/G101/ENG/GRM155R61A475MEAA-01.pdf?src-supplier=Digi-Key; ComponentLink6Description: https://search.murata.co.jp/Ceramy/image/img/A01X/G101/ENG/GRM155R61A475MEAA-01.pdf?src-supplier=Digi-Key; ComponentLink7URL: http://datasheet.octopart.com/GRM155R61A475MEAAD-Murata-datasheet-68589269.pdf?src-supplier=Future+Electronics; ComponentLink7Description: http://datasheet.octopart.com/GRM155R61A475MEAAD-Murata-datasheet-68589269.pdf?src-supplier=Future+Electronics; ComponentLink8URL: https://datasheet.octopart.com/GRM155R61A475MEAAD-Murata-datasheet-68589269.pdf?src-supplier=Newark; ComponentLink8Description: https://datasheet.octopart.com/GRM155R61A475MEAAD-Murata-datasheet-68589269.pdf?src-supplier=Newark; ComponentLink9URL: http://datasheet.octopart.com/GRM155R61A475MEAAD-Murata-datasheet-68589269.pdf?src-supplier=Verical; ComponentLink9Description: http://datasheet.octopart.com/GRM155R61A475MEAAD-Murata-datasheet-68589269.pdf?src-supplier=Verical; ComponentLink10URL: https://datasheet.octopart.com/GRM155R61A475MEAAD-Murata-datasheet-165579666.pdf?src-supplier=TME; ComponentLink10Description: https://datasheet.octopart.com/GRM155R61A475MEAAD-Murata-datasheet-165579666.pdf?src-supplier=TME; ComponentLink11URL: http://datasheet.octopart.com/GRM155R61A475MEAAD-Murata-datasheet-68589269.pdf?src-supplier=Quest; ComponentLink11Description: http://datasheet.octopart.com/GRM155R61A475MEAAD-Murata-datasheet-68589269.pdf?src-supplier=Quest; ComponentLink12URL: http://datasheet.octopart.com/GRM155R61A475MEAAD-Murata-datasheet-68589269.pdf?src-supplier=TTI; ComponentLink12Description: http://datasheet.octopart.com/GRM155R61A475MEAAD-Murata-datasheet-68589269.pdf?src-supplier=TTI; ComponentLink13URL: http://datasheet.octopart.com/GRM155R61A475MEAAD-Murata-datasheet-68589269.pdf?src-supplier=NAC+Semi; ComponentLink13Description: http://datasheet.octopart.com/GRM155R61A475MEAAD-Murata-datasheet-68589269.pdf?src-supplier=NAC+Semi; Supplier 1: Mouser; Supplier Part Number 1: 81-GRM155R61A475MEAD; Supplier 2: Farnell; Supplier Part Number 2: 3581674
P3 = 51281-1098: FFC/FPC Connector, Surface Mount, Right-Angle, Non-ZIF, Dual Contact Style; Manufacturer: Molex; Supplier: Digikey; Supplier Part Number: 900-0512811098CT-ND; Manufacturer Part Number: 51281-1098; RoHS: No; Stock: 2876; Pricing: 1=0.7, 10=0.594, 25=0.5568, 50=0.53, 100=0.5047, 250=0.47304, 500=0.45042, 1000=0.42891 (USD); ComponentLink1URL: https://datasheet.octopart.com/51281-1098-Molex-datasheet-165827616.pdf?src-supplier=Farnell; ComponentLink1Description: https://datasheet.octopart.com/51281-1098-Molex-datasheet-165827616.pdf?src-supplier=Farnell; Supplier 1: Mouser; Supplier Part Number 1: 538-51281-1098; Supplier 2: Digikey; Supplier Part Number 2: 900-0512811098CT-ND; Supplier 3: Digikey; Supplier Part Number 3: 900-0512811098DKR-ND; System: Connector

## Nets that join several sheets
1V8: SensWear_MCU (12 pins), SensWear_Memory (C5.2 R1.2 U2.A2), SensWear_Power (5 pins), SensWear_MPU (5 pins), SensWear_Debug (P2.1), SensWear_DaughterBoard (C22.2 P3.8)
GND: SensWear_MCU (22 pins), SensWear_Memory (C5.1 U2.D1), SensWear_Power (23 pins), SensWear_MPU (5 pins), SensWear_RGB (5 pins), SensWear_Debug (P2.7 P2.11), SensWear_DaughterBoard (C22.1 C23.1 C24.2 P3.10)
V_REG_IO: SensWear_Power (C15.2 U6.4), SensWear_DaughterBoard (C23.2 P3.9)
V_SYS: SensWear_Power (7 pins), SensWear_RGB (C11.1 LED1.1 U5.A2), SensWear_DaughterBoard (C24.1 P3.1)